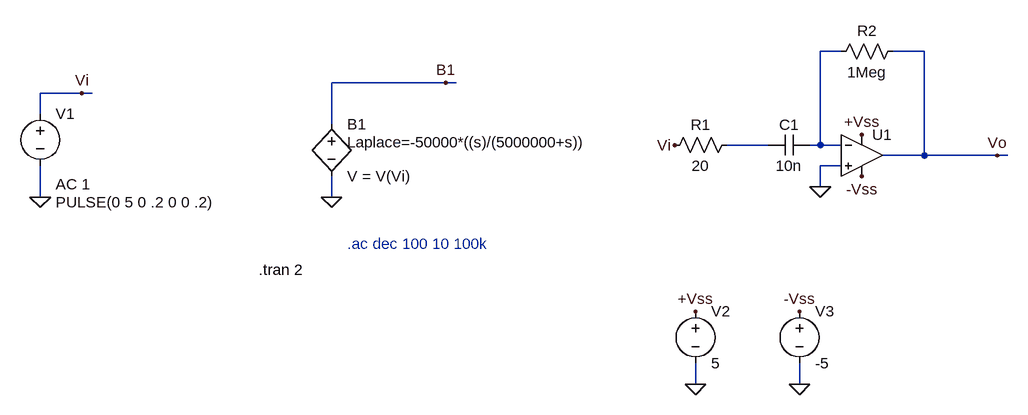
[diagram p0: schematic Pseudo differentiator.asc]
Pseudo differentiator.asc, the LTspice schematic file:
Version 4.1
SHEET 1 1044 680
WIRE 448 -32 416 -32
WIRE 576 -32 528 -32
WIRE -160 16 -336 16
WIRE -144 16 -160 16
WIRE -720 32 -784 32
WIRE -704 32 -720 32
WIRE -784 64 -784 32
WIRE -336 80 -336 16
WIRE 336 112 272 112
WIRE 416 112 416 -32
WIRE 416 112 400 112
WIRE 448 112 416 112
WIRE 576 128 576 -32
WIRE 576 128 512 128
WIRE 688 128 576 128
WIRE 704 128 688 128
WIRE 448 144 416 144
WIRE 416 176 416 144
WIRE -784 192 -784 144
WIRE -336 192 -336 160
WIRE 224 480 224 448
WIRE 384 480 384 448
FLAG -336 192 0
FLAG -720 32 Vi
FLAG -784 192 0
FLAG -160 16 B1
FLAG 416 176 0
FLAG 688 128 Vo
FLAG 192 112 Vi
FLAG 224 480 0
FLAG 384 480 0
FLAG 224 368 +Vss
FLAG 384 368 -Vss
FLAG 480 96 +Vss
FLAG 480 160 -Vss
SYMBOL bv -336 64 R0
WINDOW 123 24 44 Left 2
SYMATTR Value2 Laplace=-50000*((s)/(5000000+s))
SYMATTR InstName B1
SYMATTR Value V = V(Vi)
SYMBOL voltage -784 48 R0
WINDOW 3 24 152 Left 2
WINDOW 123 24 124 Left 2
WINDOW 39 0 0 Left 0
SYMATTR Value PULSE(0 5 0 .2 0 0 .2)
SYMATTR Value2 AC 1
SYMATTR InstName V1
SYMBOL cap 400 96 R90
WINDOW 0 0 32 VBottom 2
WINDOW 3 32 32 VTop 2
SYMATTR InstName C1
SYMATTR Value 10n
SYMBOL res 288 96 R90
WINDOW 0 0 56 VBottom 2
WINDOW 3 32 56 VTop 2
SYMATTR InstName R1
SYMATTR Value 20
SYMBOL res 544 -48 R90
WINDOW 0 0 56 VBottom 2
WINDOW 3 32 56 VTop 2
SYMATTR InstName R2
SYMATTR Value 1Meg
SYMBOL voltage 224 352 R0
WINDOW 123 0 0 Left 0
WINDOW 39 0 0 Left 0
SYMATTR InstName V2
SYMATTR Value 5
SYMBOL voltage 384 352 R0
WINDOW 123 0 0 Left 0
WINDOW 39 0 0 Left 0
SYMATTR InstName V3
SYMATTR Value -5
SYMBOL OpAmps\\UniversalOpAmp2 480 128 R0
SYMATTR InstName U1
TEXT -312 264 Left 2 ;.ac dec 100 10 100k
TEXT -448 304 Left 2 !.tran 2

The netlist it stands for:
* Pseudo differentiator.asc
B1 B1 0 V = V(Vi) Laplace=-50000*((s)/(5000000+s))
V1 Vi 0 PULSE(0 5 0 .2 0 0 .2) AC 1
C1 N001 N002 10n
R1 N002 Vi 20
R2 Vo N001 1Meg
V2 +Vss 0 5
V3 -Vss 0 -5
X§U1 0 N001 +Vss -Vss Vo level2 Avol=1Meg GBW=10Meg Slew=10Meg Ilimit=25m Rail=0 Vos=0 En=0 Enk=0 In=0 Ink=0 Rin=500Meg  ; pins In+ In- V+ V- OUT
* .ac dec 100 10 100k
.tran 2
.lib UniversalOpAmp2.lib
.backanno
.end

* Results of the author's LTspice run, read from the files saved beside the schematic
* Operating Point, zero values left out:
*   V(-vss) = -5 V
*   V(+vss) = 5 V
*   I(V2) = -500 µA
*   I(V3) = 500 µA
*   Ix(u1:3) = 500 µA
*   Ix(u1:4) = -500 µA
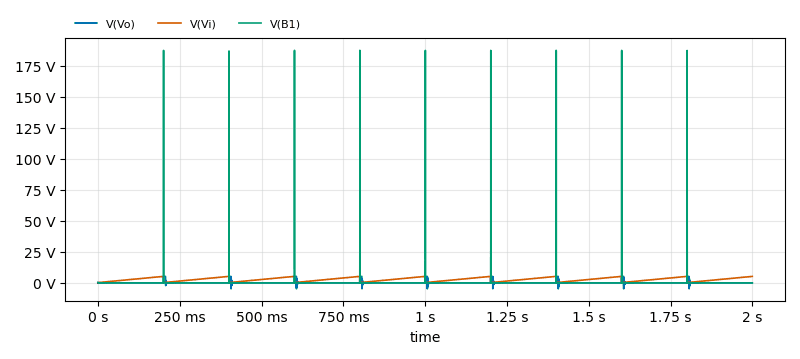
[diagram p1: Transient Analysis of Pseudo differentiator.asc, plotted from the saved traces]
* Transient Analysis, 1 run:
*   V(Vo): min -5 V, max 5 V, average -92.02 mV, rms 926.3 mV, last -250 mV
*   V(Vi): min 0 V, max 5 V, average 2.5 V, rms 2.887 V, last 5 V
*   V(B1): min -288.9 mV, max 187.3 V, average -25.25 mV, rms 5.601 V, last -250.1 mV